# Altium schematic sheet 转接板.SchDoc
size A4; SheetNumber: 1; SheetTotal: 1
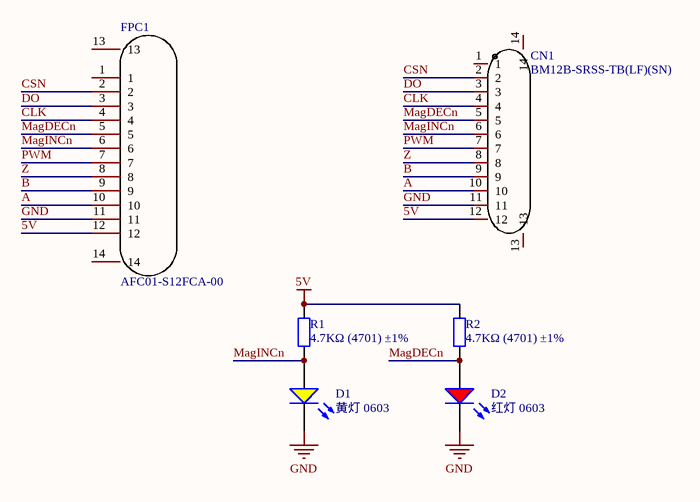
[diagram p0: 转接板.SchDoc]

## Parts
CN1  BM12B-SRSS-TB(LF)(SN)  [CONN-SMD_BM12B-SRSS-TB-LF-SN]
D1  黄灯 0603  [0603_LED_S1]
D2  红灯 0603  [0603_LED_S1]
FPC1  AFC01-S12FCA-00  [FPC-SMD_AFC01-S12FCA-00]
R1  4.7KΩ (4701) ±1%  [0603_R]
R2  4.7KΩ (4701) ±1%  [0603_R]

## Nets
5V: CN1.12 FPC1.12 R1.2 R2.2
GND: CN1.11 D1.K D2.K FPC1.11
A: CN1.10 FPC1.10
B: CN1.9 FPC1.9
CLK: CN1.4 FPC1.4
CSN: CN1.2 FPC1.2
DO: CN1.3 FPC1.3
MagDECn: CN1.5 D2.A FPC1.5 R2.1
MagINCn: CN1.6 D1.A FPC1.6 R1.1
PWM: CN1.7 FPC1.7
Z: CN1.8 FPC1.8

Not connected (* = marked no-connect by the designer): CN1 1 13 14; FPC1 1 13 14

## Library data of the parts
CN1 = BM12B-SRSS-TB(LF)(SN): 插针结构:1x12P;间距:1mm;安装方式:立贴;行距:-;总PIN数:12P;排数:1;每排PIN数:12;参考系列:SH;额定电流:1A;触头材质:铜合金;触头镀层:锡;工作温度范围:-25℃~+85℃;; Manufacturer: JST; Add into BOM: yes; Pins Structure: 1x12P; Pitch: 1mm; Number of PINs Per Row: 12; Reference Series: SH; Current Rating (Max): 1A; Symbol: BM12B-SRSS-TB(LF)(SN); Device: BM12B-SRSS-TB(LF)(SN); LCSC Part Name: 1x12P 间距:1mm 立贴 系列:SH; Supplier Part: C160398; Manufacturer Part: BM12B-SRSS-TB(LF)(SN); Supplier Footprint: SMD,P=1mm; JLCPCB Part Class: 扩展库; Datasheet: https://atta.szlcsc.com/upload/public/pdf/source/20200311/C495554_AC8A242B8341DC77B3B89EF00A1D25AF.pdf; Supplier: LCSC; Convert to PCB: yes; Mounting Style: 立贴; Row Spacing: -; Number of Pins: 12P; Number of Rows: 1; Contact Material: 铜合金; Contact Plating: 锡; Operating Temperature Range: -25℃~+85℃; Name: BM12B-SRSS-TB(LF)(SN)
D1 = 0603 黄灯: 发光二极管; ComponentLink1Description: 供应商链接; ComponentLink1URL: http://www.szlcsc.com/product/details_73147.html; Package: 0603; Supplier: LC; SuppliersPartNumber: C72038
D2 = 0603 红灯: 发光二极管; ComponentLink1Description: 供应商链接; ComponentLink1URL: http://www.szlcsc.com/product/details_2659.html; Package: 0603; Supplier: LC; SuppliersPartNumber: C2286
FPC1 = AFC01-S12FCA-00: 间距:0.5mm;触点数量:12P;锁定特性:翻盖式;触点类型:下接;安装类型:卧贴;; Manufacturer: JS(钜硕电子); Add into BOM: yes; Pitch: 0.5mm; Number of Contacts: 12P; Locking Feature: 翻盖式; FFC, FCB Thickness: 0.3mm; Symbol: AFC01-S12FCA-00; Device: AFC01-S12FCA-00; LCSC Part Name: 间距:0.5mm P数:12P 翻盖式 下接; Supplier Part: C262661; Manufacturer Part: AFC01-S12FCA-00; Supplier Footprint: SMD,P=0.5mm,卧贴; JLCPCB Part Class: 扩展库; Datasheet: https://atta.szlcsc.com/upload/public/pdf/source/20190816/C413942_2A72D1AC756EAE17EEDF756A339D4500.pdf; Supplier: LCSC; Convert to PCB: yes; Contact Type: 下接; Mounting Type: 卧贴; Height Above Board: 2mm; Name: AFC01-S12FCA-00
R1 R2 = 0603 4.7KΩ (4701) 1%: 贴片电阻; ComponentLink1Description: 供应商链接; ComponentLink1URL: http://www.szlcsc.com/product/details_23889.html; Package: 0603; Supplier: LC; SuppliersPartNumber: C23162